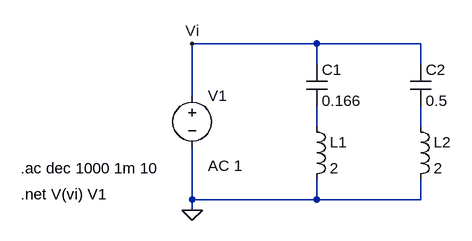
[diagram p0: schematic foster.asc]
foster.asc, the LTspice schematic file:
Version 4
SHEET 1 880 680
WIRE 208 64 16 64
WIRE 368 64 208 64
WIRE 208 96 208 64
WIRE 368 96 368 64
WIRE 16 144 16 64
WIRE 208 192 208 160
WIRE 368 192 368 160
WIRE 16 304 16 224
WIRE 208 304 208 272
WIRE 208 304 16 304
WIRE 368 304 368 272
WIRE 368 304 208 304
WIRE 16 320 16 304
FLAG 16 320 0
FLAG 16 64 Vi
SYMBOL cap 192 96 R0
SYMATTR InstName C1
SYMATTR Value 0.166
SYMBOL cap 352 96 R0
SYMATTR InstName C2
SYMATTR Value 0.5
SYMBOL ind 192 176 R0
SYMATTR InstName L1
SYMATTR Value 2
SYMATTR SpiceLine Rser=0
SYMBOL ind 352 176 R0
SYMATTR InstName L2
SYMATTR Value 2
SYMATTR SpiceLine Rser=0
SYMBOL voltage 16 128 R0
WINDOW 123 24 124 Left 2
WINDOW 39 0 0 Left 0
SYMATTR InstName V1
SYMATTR Value ""
SYMATTR Value2 AC 1
TEXT -248 256 Left 2 !.ac dec 1000 1m 10
TEXT -248 296 Left 2 !.net V(vi) V1

The netlist it stands for:
* foster.asc
C1 Vi N001 0.166
C2 Vi N002 0.5
L1 N001 0 2 Rser=0
L2 N002 0 2 Rser=0
V1 Vi 0 AC 1
.ac dec 1000 1m 10
.net V(vi) V1
.backanno
.end